# EAGLE schematic WiFi + Relays Board Kit (EAGLE 7.2.0)
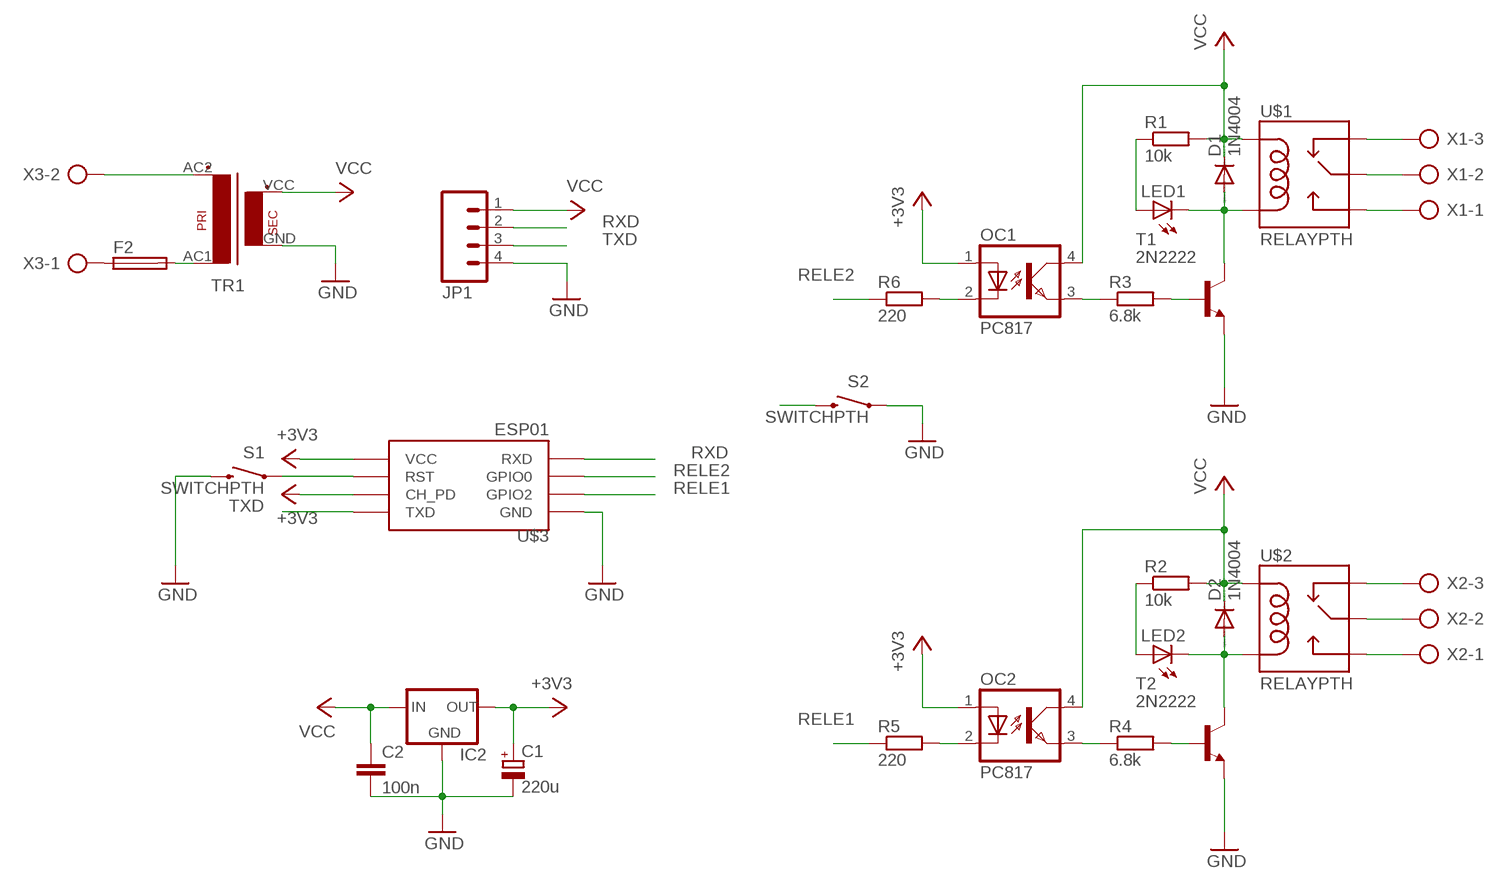
[diagram p0: schematic, sheet 1]

## Parts
C1  220u  CPOL-EUE2.5-6  [E2,5-6]
C2  100n  C-EU050-024X044  [C050-024X044]
D1  1N4004  [DO41-10]
D2  1N4004  [DO41-10]
F2  SH22,5A  [SH22,5A]
IC2  MCP1700TRI  [TO92]
JP1  M04PTH  [1X04]
LED1  LED3MM  [LED3MM]
LED2  LED3MM  [LED3MM]
OC1  PC817  [DIL04]
OC2  PC817  [DIL04]
R1  10k  R-EU_0204/7  [0204/7]
R2  10k  R-EU_0204/7  [0204/7]
R3  6.8k  R-EU_0204/7  [0204/7]
R4  6.8k  R-EU_0204/7  [0204/7]
R5  220  R-EU_0204/7  [0204/7]
R6  220  R-EU_0204/7  [0204/7]
S1  SWITCHPTH  [TACTILE-PTH]
S2  SWITCHPTH  [TACTILE-PTH]
T1  2N2222  [TO92-EBC-OVAL]
T2  2N2222  [TO92-EBC-OVAL]
TR1  HLK-PM01  [HLK-PM01]
U$1  RELAYPTH  [SRD-05VDC-SL-C]
U$2  RELAYPTH  [SRD-05VDC-SL-C]
U$3  ESP01  [ESP01]
X1  AK500/3  [AK500/3]
X2  AK500/3  [AK500/3]
X3  AK500/2  [AK500/2]

## Nets
+3V3: C1.+ IC2.3(OUT) OC1.1(A) OC2.1(A) U$3.CH_PD U$3.VCC
GND: C1.- C2.2 IC2.1(GND) JP1.4 S1.3 S2.1 T1.E T2.E TR1.GND(S4) U$3.GND
N$1: D1.A LED1.K(C) T1.C U$1.COIL0
N$2: D2.A LED2.K(C) T2.C U$2.COIL0
N$3: LED1.A R1.1
N$4: LED2.A R2.1
N$5: OC1.3(EMIT) R3.1
N$6: R3.2 T1.B
N$7: S1.1 U$3.RST
N$8: U$1.SWCLOSED(SWCLOSE) X1.3
N$9: U$1.SWCOMMON X1.2
N$10: U$1.SWOPEN X1.1
N$11: U$2.SWCLOSED(SWCLOSE) X2.3
N$12: U$2.SWCOMMON X2.2
N$13: U$2.SWOPEN X2.1
N$14: OC2.2(C) R5.2
N$15: F2.1 X3.1
N$17: OC2.3(EMIT) R4.1
N$18: R4.2 T2.B
N$19: OC1.2(C) R6.2
N$23: TR1.AC2(P2) X3.2
N$24: F2.2 TR1.AC1(P1)
RELE1: R5.1 U$3.GPIO2
RELE2: R6.1 S2.3 U$3.GPIO0
RXD: JP1.2 U$3.RX(RXD)
TXD: JP1.3 U$3.TX(TXD)
VCC: C2.1 D1.C D2.C IC2.2(IN) JP1.1 OC1.4(COL) OC2.4(COL) R1.2 R2.2 TR1.VCC(S3) U$1.COIL1 U$2.COIL1

## Library data of the parts
C1 = rcl:CPOL-EU: POLARIZED CAPACITOR, European symbol
C2 = rcl:C-EU: CAPACITOR, European symbol
D1 D2 = diode:1N4004: DIODE general purpose rectifier, 1 A
F2 = mio:SH22,5A: FUSE HOLDER grid 22,5mm, isolated cap OGN0031 8201, Schurter (Buerklin); MPN: 0031.7701.11; OC_FARNELL: unknown; OC_NEWARK: 04F1224
IC2 = adafruit:MCP1700: VOLTAGE REGULATOR
JP1 = SparkFun-Connectors:M04: Header 4 Standard 4-pin 0.1" header. Use with straight break away headers (SKU : PRT-00116), right angle break away headers (PRT-00553), swiss pins (PRT-00743), machine pins (PRT-00117), and female headers (PRT-00115). Molex polarized connector foot print use with SKU : PRT-08231 with associated crimp pins and housings. 1MM SMD Version SKU: PRT-10208
LED1 LED2 = led:LED: LED OSRAM: - CHIPLED LG R971, LG N971, LY N971, LG Q971, LY Q971, LO R971, LY R971 LH N974, LH R974 LS Q976, LO Q976, LY Q976 LO Q996 - Hyper CHIPLED LW Q18S LB Q993, LB Q99A, LB R99A - SideLED LS A670, LO A670, LY A670, LG A670, LP A670 LB A673, LV A673, LT A673, LW A673 LH A674 LY A675 LS A676, LA A676, LO A676, LY A676, LW A676 LS A679, LY A679, LG A679 - Hyper Micro SIDELED® LS Y876, LA Y876, LO Y876, LY Y876 LT Y87S - SmartLED LW L88C, LW L88S LB L89C, LB L89S, LG L890 LS L89K, LO L89K, LY L89K LS L896, LA L896, LO L896, LY L896 - TOPLED LS T670, LO T670, LY T670, LG T670, LP T670 LSG T670, LSP T670, LSY T670, LOP T670, LYG T670 LG T671, LOG T671, LSG T671 LB T673, LV T673, LT T673, LW T673 LH T674 LS T676, LA T676, LO T676, LY T676, LB T676, LH T676, LSB T676, LW T676 LB T67C, LV T67C, LT T67C, LS T67K, LO T67K, LY T67K, LW E67C LS E67B, LA E67B, LO E67B, LY E67B, LB E67C, LV E67C, LT E67C LW T67C LS T679, LY T679, LG T679 LS T770, LO T770, LY T770, LG T770, LP T770 LB T773, LV T773, LT T773, LW T773 LH T774 LS E675, LA E675, LY E675, LS T675 LS T776, LA T776, LO T776, LY T776, LB T776 LHGB T686 LT T68C, LB T68C - Hyper Mini TOPLED® LB M676 - Mini TOPLED Santana® LG M470 LS M47K, LO M47K, LY M47K Source: http://www.osram.convergy.de LUXEON: - LUMILED® LXK2-PW12-R00, LXK2-PW12-S00, LXK2-PW14-U00, LXK2-PW14-V00 LXK2-PM12-R00, LXK2-PM12-S00, LXK2-PM14-U00 LXK2-PE12-Q00, LXK2-PE12-R00, LXK2-PE12-S00, LXK2-PE14-T00, LXK2-PE14-U00 LXK2-PB12-K00, LXK2-PB12-L00, LXK2-PB12-M00, LXK2-PB14-N00, LXK2-PB14-P00, LXK2-PB14-Q00 LXK2-PR12-L00, LXK2-PR12-M00, LXK2-PR14-Q00, LXK2-PR14-R00 LXK2-PD12-Q00, LXK2-PD12-R00, LXK2-PD12-S00 LXK2-PH12-R00, LXK2-PH12-S00 LXK2-PL12-P00, LXK2-PL12-Q00, LXK2-PL12-R00 Source: www.luxeon.com KINGBRIGHT: KA-3528ASYC Source: www.kingbright.com
OC1 OC2 = optocoupler:PC817: SHARP OPTO COUPLER; MPN: PC817X4J000F; OC_FARNELL: 9707727; OC_NEWARK: 97K7059
R1 R2 = resistor:R-EU_: RESISTOR, European symbol
R3-R6 = rcl:R-EU_: RESISTOR, European symbol
S1 S2 = mio:SWITCH: Various NO switches- pushbuttons, reed, etc; PROD_ID: SWCH-08441
T1 T2 = adafruit:2N2222: NPN TRANSISTOR Big oval pads
TR1 = mio:HLK-PM01: TRANSFORMER 1 primary winding, 1 secondary winding BLOCK
U$1 U$2 = songle:RELAY: SPDT relay (COM-00101)
U$3 = esp8266modules:ESP01: ESP8266 Wifi module 01
X1 X2 = con-ptr500:AK500/3: CONNECTOR; OC_FARNELL: unknown; OC_NEWARK: unknown
X3 = con-ptr500:AK500/2: CONNECTOR; OC_FARNELL: unknown; OC_NEWARK: unknown